# EAGLE design dht11 (EAGLE 7.6.0)
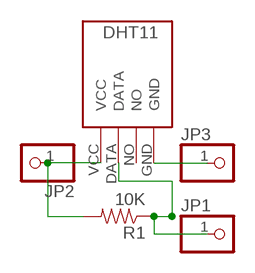
[diagram p0: schematic, sheet 1]

## Parts
JP1  PINHD-1X1  [1X01]
JP2  PINHD-1X1  [1X01]
JP3  PINHD-1X1  [1X01]
R1  10K  1KOHM-1/4W-1%(PTH)  [AXIAL-0.3]
U$1  DHT11  [DHT11]

## Nets
N$1: JP3.1 U$1.GND
N$2: JP2.1 R1.P$2 U$1.VCC
N$4: JP1.1 R1.P$1 U$1.DATA
Unconnected: U$1.NO

## Library data of the parts
JP1-JP3 = pinhead:PINHD-1X1: PIN HEADER
R1 = SparkFun-Resistors:1KOHM-1/4W-1%(PTH): RES-12182; PROD_ID: RES-12182; VALUE: 1K
U$1 = DHT11:DHT11: DHT11 Czujnik temperatury i wilgotności

## Board
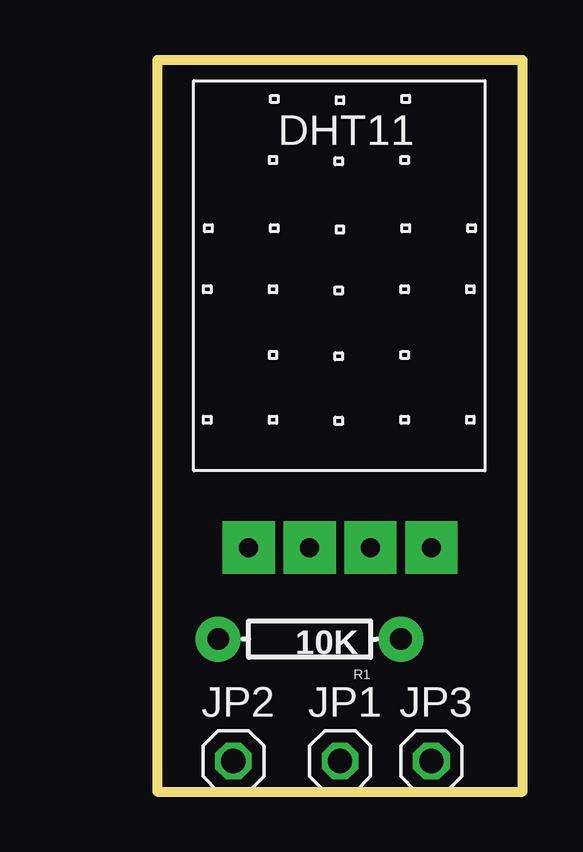
[diagram p1: board, top side]
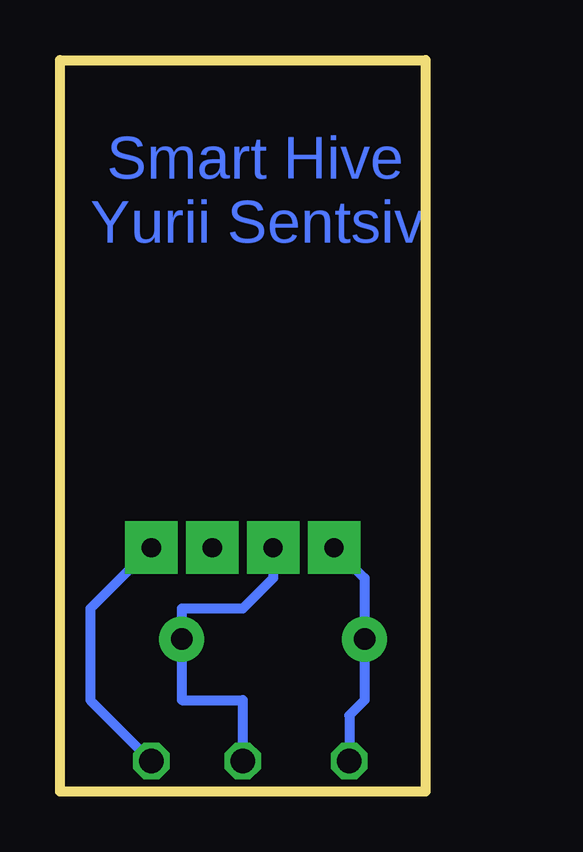
[diagram p2: board, bottom side, seen from below]

Size 15.24 x 30.48 mm. Coordinates in mm from the lower left corner, seen from the top.
Outline: 0,30.47 0,0
Outline: 0,0 0,30.48 15.24,30.48 15.24,0 0,0
Copper layers (1*16): Top 0.035mm / dielectric 1.5mm / Bottom 0.035mm
Design rules "default": minimum track width 10mil, minimum drill 24mil, track to track 8mil, track to pad 8mil, pad to pad 8mil, via to via 8mil, smd to smd 8mil, copper to edge 40mil, drill to drill 8mil, minimum pad ring 10mil, minimum via ring 8mil, stop-mask expansion 4mil, vias tented up to drill 0mil, thermal gap 10mil

### Footprints (pad centres in the part's own frame; a part is rotated, then mirrored left to right if it is on the bottom)
1X01 = drill 1.016 octagon: 1 0,0
AXIAL-0.3 = drill 0.9 pad 1.88: P$1 -3.81,0; P$2 3.81,0
DHT11 = drill 0.8 pad 2.184 square: DATA -1.27,-11.43; GND 3.81,-11.43; NO 1.27,-11.43; VCC -3.81,-11.43

### Placement (x,y rotation side)
JP1  7.62,1.27 0 top
JP2  3.17,1.27 0 top
JP3  11.43,1.27 0 top
R1  6.35,6.35 180 top
U$1  7.62,21.59 0 top

### Tracks (layer width: path | path; a pad name or v marks a point on that pad's centre or on a via)
N$1
  Bottom 0.406: U$1.GND 13.97,7.62 13.97,3.81 JP3.1
N$2
  Bottom 0.406: U$1.VCC 2.54,8.89 R1.P$2 2.54,3.81 3.17,3.17 JP2.1
N$4
  Bottom 0.406: U$1.DATA 6.35,8.89 7.62,7.62 10.16,7.62 R1.P$1 10.16,3.81 7.62,3.81 JP1.1

### Text on the board
Bottom: Smart Hive / Yurii Sentsiv